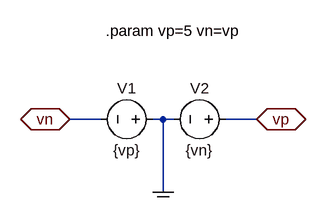
[diagram p0: schematic dualsupp.asc]
dualsupp.asc, the LTspice schematic file:
Version 4
SHEET 1 880 680
WIRE 112 128 64 128
WIRE 208 128 192 128
WIRE 224 128 208 128
WIRE 352 128 304 128
WIRE 208 240 208 128
FLAG 352 128 vp
IOPIN 352 128 BiDir
FLAG 64 128 vn
IOPIN 64 128 BiDir
FLAG 208 240 com
IOPIN 208 240 BiDir
SYMBOL voltage 208 128 R90
WINDOW 0 -32 56 VBottom 2
WINDOW 3 32 56 VTop 2
WINDOW 123 0 0 Left 0
WINDOW 39 0 0 Left 0
SYMATTR InstName V1
SYMATTR Value {vp}
SYMBOL voltage 320 128 R90
WINDOW 0 -32 56 VBottom 2
WINDOW 3 32 56 VTop 2
WINDOW 123 0 0 Left 0
WINDOW 39 0 0 Left 0
SYMATTR InstName V2
SYMATTR Value {vn}
TEXT 120 -8 Left 2 !.param vp=5 vn=vp

The netlist it stands for:
* dualsupp.asc
V1 com vn {vp}
V2 vp com {vn}
.param vp=5 vn=vp
.backanno
.end